# EAGLE schematic Geiger (EAGLE 5.06)
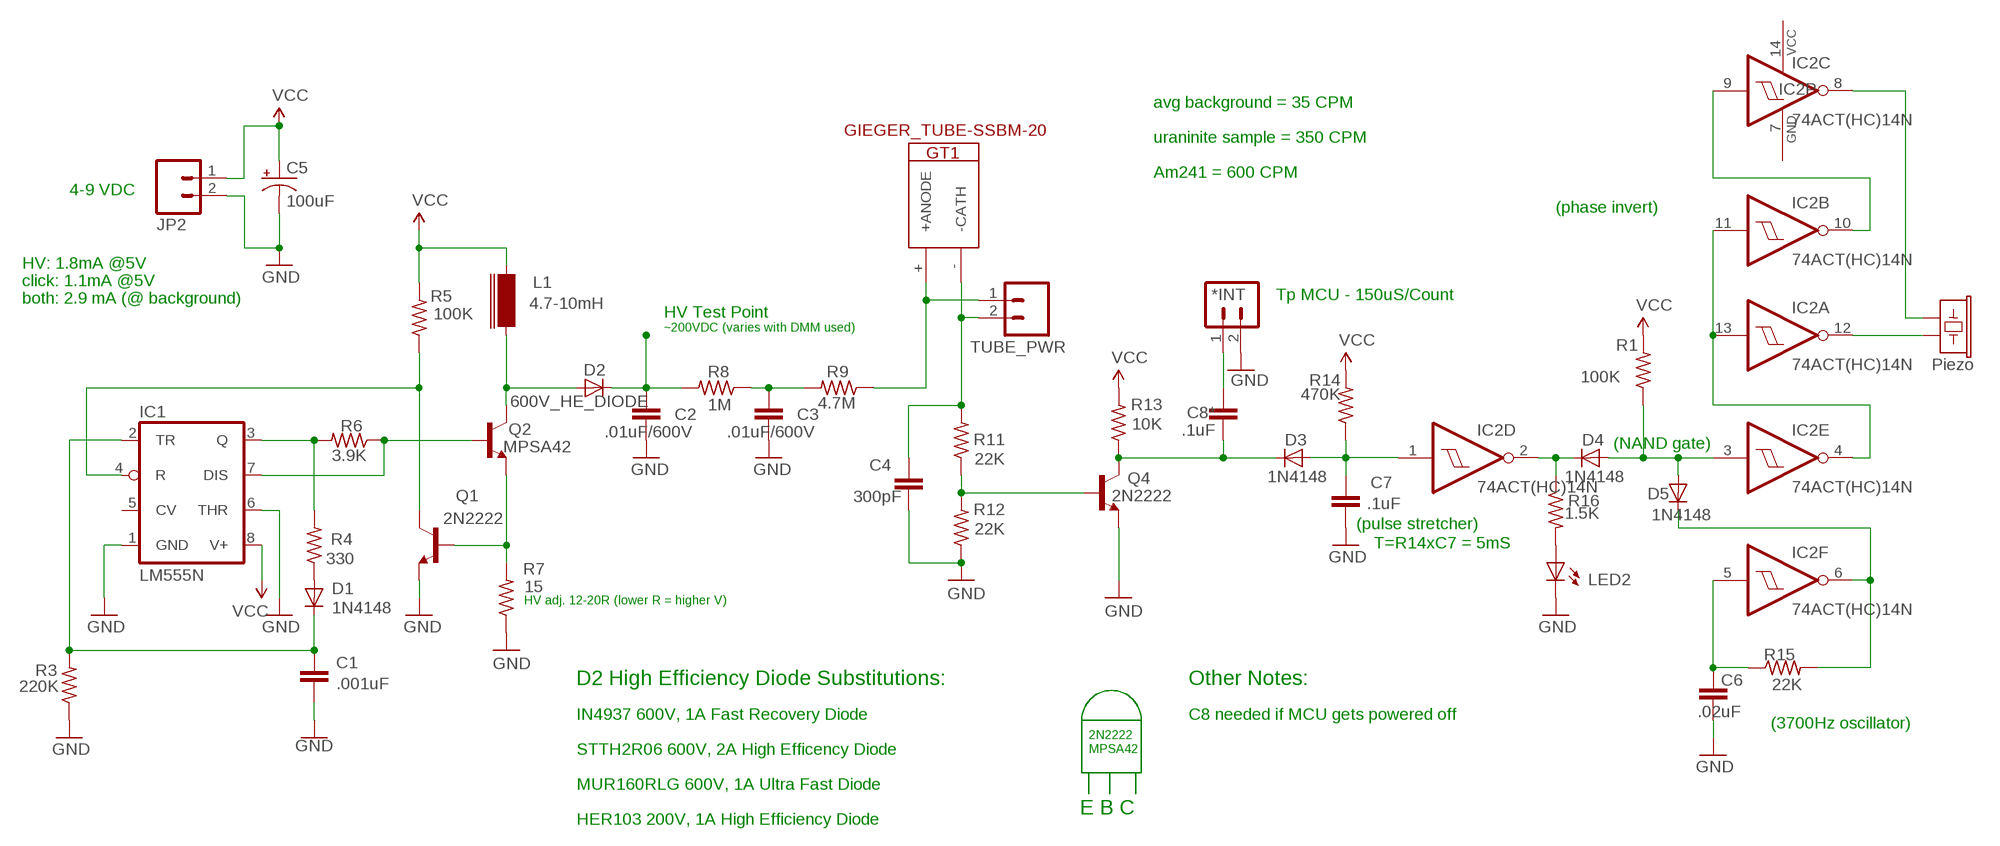
[diagram p0: schematic, sheet 1]

## Parts
*INT  M02PTH  [1X02]
C1  .001uF  CAPPTH  [CAP-PTH-SMALL]
C2  .01uF/600V  C-EU050-025X075  [C050-025X075]
C3  .01uF/600V  C-EU050-025X075  [C050-025X075]
C4  300pF  CAPPTH  [CAP-PTH-SMALL]
C5  100uF  CAP_POLPTH1  [CPOL-RADIAL-100UF-25V]
C6  .02uF  CAPPTH  [CAP-PTH-SMALL]
C7  .1uF  CAPPTH  [CAP-PTH-SMALL]
C8*  .1uF  CAPPTH  [CAP-PTH-SMALL]
D1  1N4148  DIODE-VERTDIODE_SM_VERT  [0204V]
D2  600V_HE_DIODE  DIODE-VERT  [VERT_DIODE]
D3  1N4148  DIODE-VERTDIODE_SM_VERT  [0204V]
D4  1N4148  DIODE-VERTDIODE_SM_VERT  [0204V]
D5  1N4148  DIODE-VERTDIODE_SM_VERT  [0204V]
GT1  GIEGER_TUBE-SSBM-20  GIEGER_TUBESSBM-20  [GEIGER_TUBE_SBM-20]
IC1  LM555N  [DIL08]
IC2  74ACT(HC)14N  7414N  [DIL14]
JP2  M02SCREW  [SCREWTERMINAL-3.5MM-2]
L1  4.7-10mH  INDUCTOR_4.7MH-1000  [.32IN_RADIAL]
LED2  LED3MM  [LED3MM]
Q1  2N2222  TRANSISTOR_NPNTO92  [TO-92]
Q2  MPSA42  TRANSISTOR_NPNTO92  [TO-92]
Q4  2N2222  TRANSISTOR_NPNTO92  [TO-92]
R1  100K  R-US_0204/2V  [0204V]
R3  220K  R-US_0204/2V  [0204V]
R4  330  R-US_0204/2V  [0204V]
R5  100K  R-US_0204/2V  [0204V]
R6  3.9K  R-US_0204/2V  [0204V]
R7  15  R-US_0204/2V  [0204V]
R8  1M  R-US_0204/2V  [0204V]
R9  4.7M  R-US_0204/2V  [0204V]
R11  22K  R-US_0204/2V  [0204V]
R12  22K  R-US_0204/2V  [0204V]
R13  10K  R-US_0204/2V  [0204V]
R14  470K  R-US_0204/2V  [0204V]
R15  22K  R-US_0204/2V  [0204V]
R16  1.5K  R-US_0204/2V  [0204V]
SG1  Piezo  BUZZERPTH  [BUZZER-12MM]
TUBE_PWR  M02SCREW  [SCREWTERMINAL-3.5MM-2]

## Nets
GND: *INT.2 C1.1 C2.2 C3.2 C4.1 C5.2(-) C6.2 C7.2 IC1.1(GND) IC1.6(THR) JP2.2 LED2.K(C) Q1.1(E) Q4.1(E) R3.1 R7.1 R12.1
N$1: IC1.3(Q) R4.2 R6.2
N$2: C2.1 D2.2(C) R8.2
N$3: C7.1 D3.1(A) IC2.1(D:I) R14.1
N$4: C1.2 D1.2(C) IC1.2(TR) R3.2
N$5: C4.2 GT1.-(-CATH) R11.2 TUBE_PWR.2
N$6: C3.1 R8.1 R9.2
N$7: GT1.+(+ANODE) R9.1 TUBE_PWR.1
N$8: Q4.2(B) R11.1 R12.2
N$9: D4.2(C) IC2.2(D:O) R16.1
N$10: IC1.7(DIS) Q2.2(B) R6.1
N$11: D4.1(A) D5.1(A) IC2.3(E:I) R1.1
N$12: IC1.4(R) Q1.3(C) R5.1
N$13: D1.1(A) R4.1
N$14: C8*.2 D3.2(C) Q4.3(C) R13.1
N$15: Q1.2(B) Q2.1(E) R7.2
N$16: *INT.1 C8*.1
N$17: D2.1(A) L1.2 Q2.3(C)
N$18: IC2.9(C:I) IC2.10(B:O)
N$19: D5.2(C) IC2.6(F:O) R15.2
N$21: C6.1 IC2.5(F:I) R15.1
N$22: IC2.4(E:O) IC2.11(B:I) IC2.13(A:I)
N$24: IC2.12(A:O) SG1.-
N$26: IC2.8(C:O) SG1.+
N$27: LED2.A R16.2
VCC: C5.1(+) IC1.8(V+) JP2.1 L1.1 R1.2 R5.2 R13.2 R14.2
Unconnected: IC1.5(CV)

## Notes on the sheet
- avg background = 35 CPM
- uraninite sample = 350 CPM
- Am241 = 600 CPM
- 4-9 VDC
- (phase invert)
- HV: 1.8mA @5V
- click: 1.1mA @5V
- both: 2.9 mA (@ background) | Tp MCU - 150uS/Count
- HV Test Point
- ~200VDC (varies with DMM used)
- (NAND gate)
- (pulse stretcher)
- T=R14xC7 = 5mS
- HV adj. 12-20R (lower R = higher V)
- D2 High Efficiency Diode Substitutions: | Other Notes:
- IN4937 600V, 1A Fast Recovery Diode | C8 needed if MCU gets powered off
- (3700Hz oscillator)
- 2N2222
- STTH2R06 600V, 2A High Efficency Diode | MPSA42
- MUR160RLG 600V, 1A Ultra Fast Diode
- E B C
- HER103 200V, 1A High Efficiency Diode

## Power pins joined to a net without a drawn wire
GND: IC2.7(P:GND)
VCC: IC2.14(P:VCC)

## Library data of the parts
*INT JP2 TUBE_PWR = _JJG-parts:M02: Header 2 Standard 2-pin 0.1" header. Use with straight break away headers (SKU : PRT-00116), right angle break away headers (PRT-00553), swiss pins (PRT-00743), machine pins (PRT-00117), and female headers (PRT-00115). Molex polarized connector foot print use with SKU : PRT-08233 with associated crimp pins and housings.
C1 C4 C6 C7 C8* = SparkFun:CAP: Capacitor Standard 0603 ceramic capacitor, and 0.1" leaded capacitor.
C2 C3 = resistor:C-EU: CAPACITOR, European symbol
C5 = SparkFun:CAP_POL: Capacitor Polarized These are standard SMD and PTH capacitors. Normally 10uF, 47uF, and 100uF in electrolytic and tantalum varieties. Always verify the external diameter of the through hole cap, it varies with capacity, voltage, and manufacturer. The EIA devices should be standard.
D1-D5 = _JJG-parts:DIODE-VERT: DIODE vertical general purpose 1A diode,
GT1 = _JJG-parts:GIEGER_TUBES: Russinn Geiger Tubes: 3I-3GB - Electronic Goldmine part # G17365 SBM-20 - gstube.com
IC1 = linear:*555: TIMER
IC2 = 74xx-us:74*14: Hex schmitt trigger INVERTER
L1 = _JJG-parts:INDUCTOR_4.7MH: INDUCTOR - .47 mH Goldmine #G16604
LED2 = SparkFun:LED: LEDs Standard schematic elements and footprints for 5mm, 3mm, 1206, and 0603 sized LEDs. 5mm - Spark Fun Electronics SKU : COM-00529 (and others)
Q1 Q2 Q4 = SparkFun:TRANSISTOR_NPN: Transistor NPN BJT configuration in SOT23 package. MMBT2222 is the common NPN we use. Double check BCE configuration again layout.
R1 R3-R9 R11-R16 = rcl:R-US_: RESISTOR, American symbol
SG1 = SparkFun:BUZZER: Buzzer 12mm Spark Fun Electronics SKU : Comp-Buzzer